# Altium project PCB_Buck_power.PrjPcb
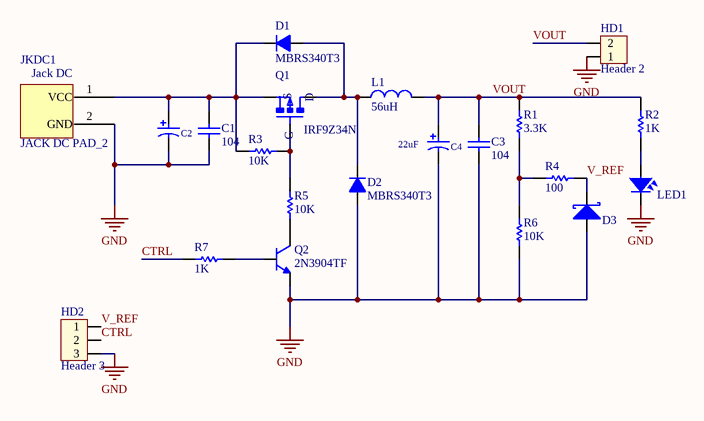
[diagram p0: schematic.SchDoc]
1 sheet, 21 parts. Net scope: global (net labels, ports and power ports of the same name join across sheets).
Board file: PCB_layout.PcbDoc

## Sheet schematic.SchDoc
size A4; SheetNumber: 1; SheetTotal: 1

### Parts
C1  104  [CAP_NP_100]
C2  470uF  [CAP_100uF_16V - duplicate]  (value not drawn)
C3  104  [CAP_NP_100]
C4  22uF  [CAPPRD350W60D800H1150]
D1  MBRS340T3  [D1A]
D2  MBRS340T3  [D1A]
D3  Diode  [Diode_zener]  (value not drawn)
HD1  Header 2  [HED2]
HD2  Header 3  [HED3]
JKDC1  JACK DC PAD_2  [Jack_DC]
L1  56uH  [L_SMD_33uH_4.2A]
LED1  LED  [LED-3]  (value not drawn)
Q1  IRF9Z34N  [TO220V]
Q2  2N3904TF  [TO92254P520H877-3]
R1  value 3.3K  [R1/4W]  (hidden comment: Res1)
R2  value 1K  [R1/4W]  (hidden comment: Res1)
R3  value 10K  [R1/4W]  (hidden comment: Res1)
R4  value 100  [R1/4W]  (hidden comment: Res1)
R5  value 10K  [R1/4W]  (hidden comment: Res1)
R6  value 10K  [R1/4W]  (hidden comment: Res1)
R7  value 1K  [R1/4W]  (hidden comment: Res1)

### Nets
GND: C1.1 C2.N C3.1 C4.N D2.1(A) D3.1(A) HD1.1 HD2.3 JKDC1.2(GND) LED1.2 Q2.1(E) R6.2
CTRL: HD2.2 R7.1
V_REF: D3.2(K) HD2.1 R4.2
VOUT: C3.2 C4.P HD1.2 L1.2 R1.1 R2.2
NetC1_2: C1.2 C2.P D1.2(K) JKDC1.1(VCC) Q1.3(S) R3.1
NetD1_1: D1.1(A) D2.2(K) L1.1 Q1.2(D)
NetLED1_1: LED1.1 R2.1
NetQ1_1: Q1.1(G) R3.2 R5.2
NetQ2_2: Q2.2(B) R7.2
NetQ2_3: Q2.3(C) R5.1
NetR1_2: R1.2 R4.1 R6.1

### Notes on the sheet
- (in symbol JACK DC PAD_2) Jack DC

### Library data of the parts
C1 C3 = Cap Semi: Capacitor (Semiconductor SIM Model); VALUE: CN?; LatestRevisionDate: 17-Jul-2002; LatestRevisionNote: Re-released for DXP Platform.; PackageReference: C1206; Publisher: Altium Limited; Value: 104
C2 = Cap_22uF_16V_pad: Polarized Capacitor 35V; Manufacturer: FARNELL; AEMS Code: 2100110; Vendor: Digikey; Published: 13-April-2009; Publisher: Hoang Nguyen; ComponentLink1Description: Digikey Part Link; ComponentLink2Description: Open Datasheet; ComponentLink2URL: H:\LIBRARY\LIBRARY.Datasheet\
C4 = Cap_8x12_pad_1: Polarized Capacitor 35V; Manufacturer: FARNELL; AEMS Code: 2100110; Vendor: Digikey; Published: 13-April-2009; Publisher: Hoang Nguyen; ComponentLink1Description: Digikey Part Link; ComponentLink2Description: Open Datasheet; ComponentLink2URL: H:\LIBRARY\LIBRARY.Datasheet\
D1 D2 = D1A: Diode 1A; Value: 1N4007
D3 = Diode zenner 5V: Default Diode; Code - JEDEC: DO-214-AB; Value: 1N5007; Published: 8-Jun-2000; Revision: July-2002: Re-released for DXP Platform.; Publisher: Altium Limited
HD1 = Header_green_2pin: Header 2 (Green); Value: Header 2
HD2 = Header_green_3pin: Header 3 (Green); Value: Header 3
L1 = L_33uH_smd_1: inductor 33uH 4.2A; Value: 150 mH
LED1 = LED: LED Single colour Green and Red; Value: LED 3 ly Single Colour
Q1 = IRF9Z34N: P-Channel 55V 19A (Tc) 3.8W (Ta), 68W (Tc) Surface Mount D2PAK; MF: Infineon Technologies; SnapEDA_Link: https://www.snapeda.com/parts/IRF9Z34N/Infineon/view-part/?ref=snap; Package: TO-220 Infineon; Value: *; MP: IRF9Z34N; Check_prices: https://www.snapeda.com/parts/IRF9Z34N/Infineon/view-part/?ref=eda
Q2 = 2N3904TF: Transistor General Purpose BJT NPN 40 Volt 0.2 Amp 3-Pin TO-92 Tape And Reel; MF: Fairchild Semiconductor; SnapEDA_Link: https://www.snapeda.com/parts/2N3904TF/Fairchild+Imaging/view-part/?ref=snap; Package: TO-92-3 ON Semiconductor; Value: *; MP: 2N3904TF; Check_prices: https://www.snapeda.com/parts/2N3904TF/Fairchild+Imaging/view-part/?ref=eda
R1-R7 = Res1_4: Resistor; Manufacturer: Generic Components; Class: Passive; Published: 08/06/2000; Publisher: Altium Hobart Technology Centre; SubClass: Resistor